# Altium schematic sheet Sheet1.SchDoc
size A2; SheetNumber: 1; SheetTotal: 1
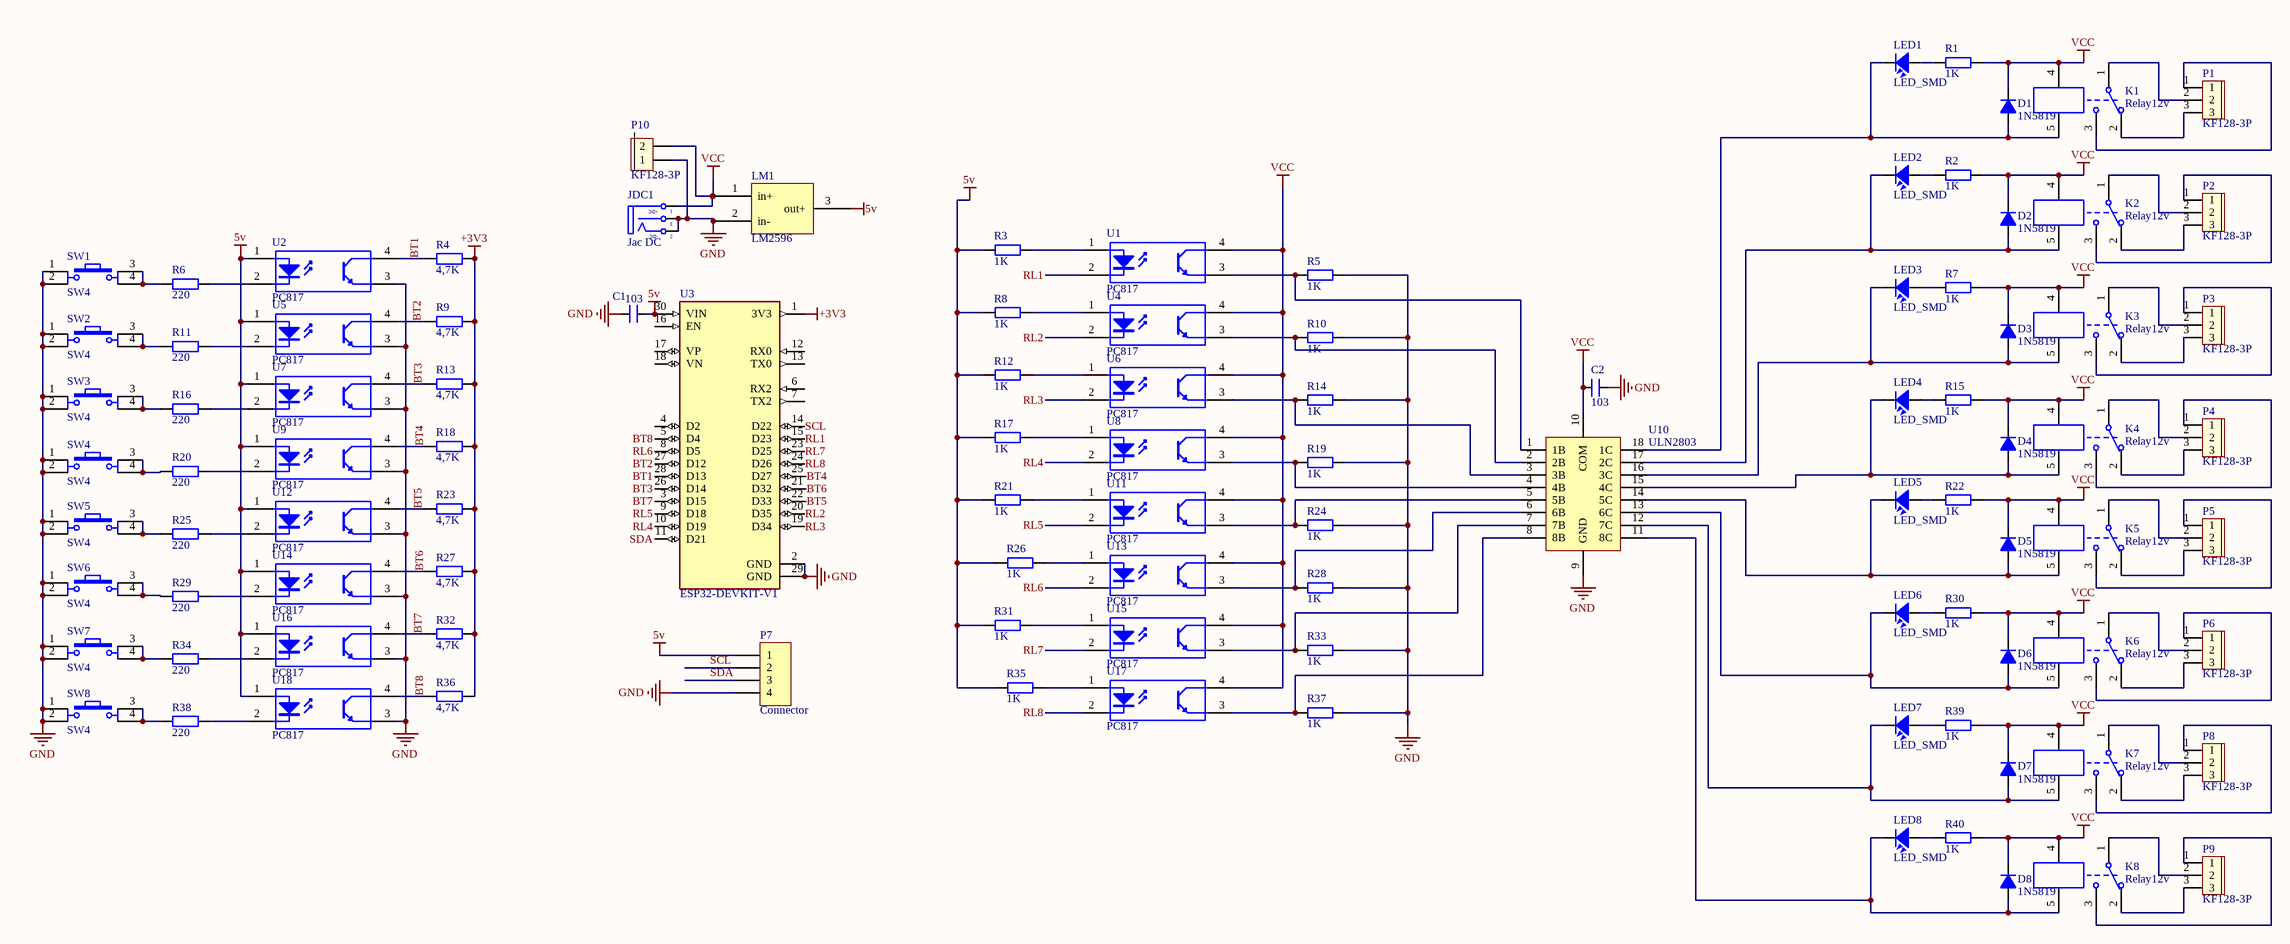
[diagram p0: Sheet1.SchDoc]

## Parts
C1  103  [SM-1206]
C2  103  [SM-1206]
D1  1N5819  [diot_smd]
D2  1N5819  [diot_smd]
D3  1N5819  [diot_smd]
D4  1N5819  [diot_smd]
D5  1N5819  [diot_smd]
D6  1N5819  [diot_smd]
D7  1N5819  [diot_smd]
D8  1N5819  [diot_smd]
JDC1  Jac DC  [DC-IN]
K1  Relay12v  [RELAY-10A5pin]
K2  Relay12v  [RELAY-10A5pin]
K3  Relay12v  [RELAY-10A5pin]
K4  Relay12v  [RELAY-10A5pin]
K5  Relay12v  [RELAY-10A5pin]
K6  Relay12v  [RELAY-10A5pin]
K7  Relay12v  [RELAY-10A5pin]
K8  Relay12v  [RELAY-10A5pin]
LED1  LED_SMD  [SM-LED-GEEN 1206]
LED2  LED_SMD  [SM-LED-GEEN 1206]
LED3  LED_SMD  [SM-LED-GEEN 1206]
LED4  LED_SMD  [SM-LED-GEEN 1206]
LED5  LED_SMD  [SM-LED-GEEN 1206]
LED6  LED_SMD  [SM-LED-GEEN 1206]
LED7  LED_SMD  [SM-LED-GEEN 1206]
LED8  LED_SMD  [SM-LED-GEEN 1206]
LM1  LM2596  [module2596_DUNG]
P1  KF128-3P  [con 3 kf128]
P2  KF128-3P  [con 3 kf128]
P3  KF128-3P  [con 3 kf128]
P4  KF128-3P  [con 3 kf128]
P5  KF128-3P  [con 3 kf128]
P6  KF128-3P  [con 3 kf128]
P7  Connector  [JST-XH_B4B-XH-A]
P8  KF128-3P  [con 3 kf128]
P9  KF128-3P  [con 3 kf128]
P10  KF128-3P  [con 2 kf128]
R1  1K  [SM-1206]
R2  1K  [SM-1206]
R3  1K  [SM-1206]
R4  4,7K  [SM-1206]
R5  1K  [SM-1206]
R6  220  [SM-1206]
R7  1K  [SM-1206]
R8  1K  [SM-1206]
R9  4,7K  [SM-1206]
R10  1K  [SM-1206]
R11  220  [SM-1206]
R12  1K  [SM-1206]
R13  4,7K  [SM-1206]
R14  1K  [SM-1206]
R15  1K  [SM-1206]
R16  220  [SM-1206]
R17  1K  [SM-1206]
R18  4,7K  [SM-1206]
R19  1K  [SM-1206]
R20  220  [SM-1206]
R21  1K  [SM-1206]
R22  1K  [SM-1206]
R23  4,7K  [SM-1206]
R24  1K  [SM-1206]
R25  220  [SM-1206]
R26  1K  [SM-1206]
R27  4,7K  [SM-1206]
R28  1K  [SM-1206]
R29  220  [SM-1206]
R30  1K  [SM-1206]
R31  1K  [SM-1206]
R32  4,7K  [SM-1206]
R33  1K  [SM-1206]
R34  220  [SM-1206]
R35  1K  [SM-1206]
R36  4,7K  [SM-1206]
R37  1K  [SM-1206]
R38  220  [SM-1206]
R39  1K  [SM-1206]
R40  1K  [SM-1206]
SW1  SW4  [SW4]
SW2  SW4  [SW4]
SW3  SW4  [SW4]
SW4  SW4  [SW4]
SW5  SW4  [SW4]
SW6  SW4  [SW4]
SW7  SW4  [SW4]
SW8  SW4  [SW4]
U1  PC817  [PhotoCoupler_SMD]
U2  PC817  [PhotoCoupler_SMD]
U3  ESP32-DEVKIT-V1  [MODULE_ESP32_DEVKIT_V1]
U4  PC817  [PhotoCoupler_SMD]
U5  PC817  [PhotoCoupler_SMD]
U6  PC817  [PhotoCoupler_SMD]
U7  PC817  [PhotoCoupler_SMD]
U8  PC817  [PhotoCoupler_SMD]
U9  PC817  [PhotoCoupler_SMD]
U10  ULN2803  [SO-18]
U11  PC817  [PhotoCoupler_SMD]
U12  PC817  [PhotoCoupler_SMD]
U13  PC817  [PhotoCoupler_SMD]
U14  PC817  [PhotoCoupler_SMD]
U15  PC817  [PhotoCoupler_SMD]
U16  PC817  [PhotoCoupler_SMD]
U17  PC817  [PhotoCoupler_SMD]
U18  PC817  [PhotoCoupler_SMD]

## Nets
5v: C1.1 LM1.3(out+) P7.1 R3.1 R8.1 R12.1 R17.1 R21.1 R26.1 R31.1 R35.1 U2.1(A) U3.30(VIN) U5.1(A) U7.1(A) U9.1(A) U12.1(A) U14.1(A) U16.1(A) U18.1(A)
+3V3: R4.2 R9.2 R13.2 R18.2 R23.2 R27.2 R32.2 R36.2 U3.1(3V3)
GND: C1.2 C2.1 JDC1.2(TN) JDC1.3(S) LM1.2(in-) P7.4 P10.1 R5.2 R10.2 R14.2 R19.2 R24.2 R28.2 R33.2 R37.2 SW1.1 SW1.2 SW2.1 SW2.2 SW3.1 SW3.2 SW4.1 SW4.2 SW5.1 SW5.2 SW6.1 SW6.2 SW7.1 SW7.2 SW8.1 SW8.2 U2.3(E) U3.2(GND) U3.29(GND) U5.3(E) U7.3(E) U9.3(E) U10.9(GND) U12.3(E) U14.3(E) U16.3(E) U18.3(E)
VCC: C2.2 D1.2(K) D2.2(K) D3.2(K) D4.2(K) D5.2(K) D6.2(K) D7.2(K) D8.2(K) JDC1.1(T) K1.4 K2.4 K3.4 K4.4 K5.4 K6.4 K7.4 K8.4 LM1.1(in+) P10.2 R1.2 R2.2 R7.2 R15.2 R22.2 R30.2 R39.2 R40.2 U1.4(C) U4.4(C) U6.4(C) U8.4(C) U10.10(COM) U11.4(C) U13.4(C) U15.4(C) U17.4(C)
BT1: R4.1 U2.4(C) U3.28(D13)
BT2: R9.1 U3.27(D12) U5.4(C)
BT3: R13.1 U3.26(D14) U7.4(C)
BT4: R18.1 U3.25(D27) U9.4(C)
BT5: R23.1 U3.22(D33) U12.4(C)
BT6: R27.1 U3.21(D32) U14.4(C)
BT7: R32.1 U3.3(D15) U16.4(C)
BT8: R36.1 U3.5(D4) U18.4(C)
RL1: U1.2(K) U3.15(D23)
RL2: U3.20(D35) U4.2(K)
RL3: U3.19(D34) U6.2(K)
RL4: U3.10(D19) U8.2(K)
RL5: U3.9(D18) U11.2(K)
RL6: U3.8(D5) U13.2(K)
RL7: U3.23(D25) U15.2(K)
RL8: U3.24(D26) U17.2(K)
SCL: P7.2 U3.14(D22)
SDA: P7.3 U3.11(D21)
NetD1_1: D1.1(A) K1.5 LED1.2 U10.18(1C)
NetD2_1: D2.1(A) K2.5 LED2.2 U10.17(2C)
NetD3_1: D3.1(A) K3.5 LED3.2 U10.16(3C)
NetD4_1: D4.1(A) K4.5 LED4.2 U10.15(4C)
NetD5_1: D5.1(A) K5.5 LED5.2 U10.14(5C)
NetD6_1: D6.1(A) K6.5 LED6.2 U10.13(6C)
NetD7_1: D7.1(A) K7.5 LED7.2 U10.12(7C)
NetD8_1: D8.1(A) K8.5 LED8.2 U10.11(8C)
NetK1_1: K1.1(COM) P1.2
NetK1_2: K1.2(NC) P1.3
NetK1_3: K1.3(NO) P1.1
NetK2_1: K2.1(COM) P2.2
NetK2_2: K2.2(NC) P2.3
NetK2_3: K2.3(NO) P2.1
NetK3_1: K3.1(COM) P3.2
NetK3_2: K3.2(NC) P3.3
NetK3_3: K3.3(NO) P3.1
NetK4_1: K4.1(COM) P4.2
NetK4_2: K4.2(NC) P4.3
NetK4_3: K4.3(NO) P4.1
NetK5_1: K5.1(COM) P5.2
NetK5_2: K5.2(NC) P5.3
NetK5_3: K5.3(NO) P5.1
NetK6_1: K6.1(COM) P6.2
NetK6_2: K6.2(NC) P6.3
NetK6_3: K6.3(NO) P6.1
NetK7_1: K7.1(COM) P8.2
NetK7_2: K7.2(NC) P8.3
NetK7_3: K7.3(NO) P8.1
NetK8_1: K8.1(COM) P9.2
NetK8_2: K8.2(NC) P9.3
NetK8_3: K8.3(NO) P9.1
NetLED1_1: LED1.1 R1.1
NetLED2_1: LED2.1 R2.1
NetLED3_1: LED3.1 R7.1
NetLED4_1: LED4.1 R15.1
NetLED5_1: LED5.1 R22.1
NetLED6_1: LED6.1 R30.1
NetLED7_1: LED7.1 R39.1
NetLED8_1: LED8.1 R40.1
NetR3_2: R3.2 U1.1(A)
NetR5_1: R5.1 U1.3(E) U10.1(1B)
NetR6_1: R6.1 SW1.3 SW1.4
NetR6_2: R6.2 U2.2(K)
NetR8_2: R8.2 U4.1(A)
NetR10_1: R10.1 U4.3(E) U10.2(2B)
NetR11_1: R11.1 SW2.3 SW2.4
NetR11_2: R11.2 U5.2(K)
NetR12_2: R12.2 U6.1(A)
NetR14_1: R14.1 U6.3(E) U10.3(3B)
NetR16_1: R16.1 SW3.3 SW3.4
NetR16_2: R16.2 U7.2(K)
NetR17_2: R17.2 U8.1(A)
NetR19_1: R19.1 U8.3(E) U10.4(4B)
NetR20_1: R20.1 SW4.3 SW4.4
NetR20_2: R20.2 U9.2(K)
NetR21_2: R21.2 U11.1(A)
NetR24_1: R24.1 U10.5(5B) U11.3(E)
NetR25_1: R25.1 SW5.3 SW5.4
NetR25_2: R25.2 U12.2(K)
NetR26_2: R26.2 U13.1(A)
NetR28_1: R28.1 U10.6(6B) U13.3(E)
NetR29_1: R29.1 SW6.3 SW6.4
NetR29_2: R29.2 U14.2(K)
NetR31_2: R31.2 U15.1(A)
NetR33_1: R33.1 U10.7(7B) U15.3(E)
NetR34_1: R34.1 SW7.3 SW7.4
NetR34_2: R34.2 U16.2(K)
NetR35_2: R35.2 U17.1(A)
NetR37_1: R37.1 U10.8(8B) U17.3(E)
NetR38_1: R38.1 SW8.3 SW8.4
NetR38_2: R38.2 U18.2(K)

Not connected (* = marked no-connect by the designer): U3 4(D2) 6(RX2) 7(TX2) 12(RX0) 13(TX0) 16(EN) 17(VP) 18(VN)

## Notes on the sheet
- (in symbol DCIN) +DC; -DC

## Library data of the parts
C1 C2 = CM: Cap SMD; Value: 103
JDC1 = DCIN: Jac DC input; Value: Jac DC
K1-K8 = Relay-SRD-05VDC-SL-C1: SRD-05VDC-SL-C1; Published: 24-Mar-1999; LatestRevisionDate: 17-Jul-2002; LatestRevisionNote: Re-released for DXP Platform.; PackageReference: DIP-P8; Publisher: Altium Limited
LM1 = LM2596 module_dung
P1-P6 P8 P9 = Con 3 KF128: Cắm; Don_Vi: Con; So_Chan: 3; Ten_Linh_Kien: CON3 KF128-3P 5.08MM; Ma_Hang: MH000983; Chung_Loai: Cắm; Kieu_Chan: *
P7 = Connector_4pin
P10 = Con 2 KF128: Cắm; Don_Vi: Con; So_Chan: 3; Ten_Linh_Kien: CON3 KF128-3P 5.08MM; Ma_Hang: MH000983; Chung_Loai: Cắm; Kieu_Chan: *
R1-R3 R5 R7 R8 R10 R12 R14 R15 R17 R19 R21 R22 R24 R26 R28 R30 R31 R33 R35 R37 R39 R40 = RM: Resistor SMD; Value: 1K
R4 R6 R9 R11 R13 R16 R18 R20 R23 R25 R27 R29 R32 R34 R36 R38 = RM: Resistor SMD; Value: 1K
SW1-SW8 = SW4: Switch button 4 pin; Value: Button chip 4 pin
U1 U2 U4-U9 U11-U18 = PC817: 4-Pin Phototransistor Optocoupler; Published: 24-Mar-1999; LatestRevisionDate: 04-Mar-2005; LatestRevisionNote: Sch pins 3 & 4 Swapped.; DatasheetVersion: Nov-2003; PackageReference: DIP-4; Publisher: Altium Limited
U3 = ESP32-DEVKIT-V1: Dual core, Wi-Fi: 2.4 GHz up to 150 Mbits/s,BLE (Bluetooth Low Energy) and legacy Bluetooth, 32 bits, Up to 240 MHz; MF: Do it; Price: None; Availability: Not in stock; Package: None; MP: ESP32-DEVKIT-V1; Value: *; SnapEDA_Link: https://www.snapeda.com/parts/ESP32-DEVKIT-V1/Do+it/view-part/?ref=snap; Check_prices: https://www.snapeda.com/parts/ESP32-DEVKIT-V1/Do+it/view-part/?ref=eda
U10 = ULN2803: ULN2803A Darlington Transistor Arrays